# EasyEDA schematic SCH_Control-Board_2024-08-24.json
TITLE: Avalon Series Control Board; REV: 4.0; Date: 2024-06-21; Sheet: 1/1; Drawn By: edwardkeate; Company: Stoke PEV Solutions UK LLP
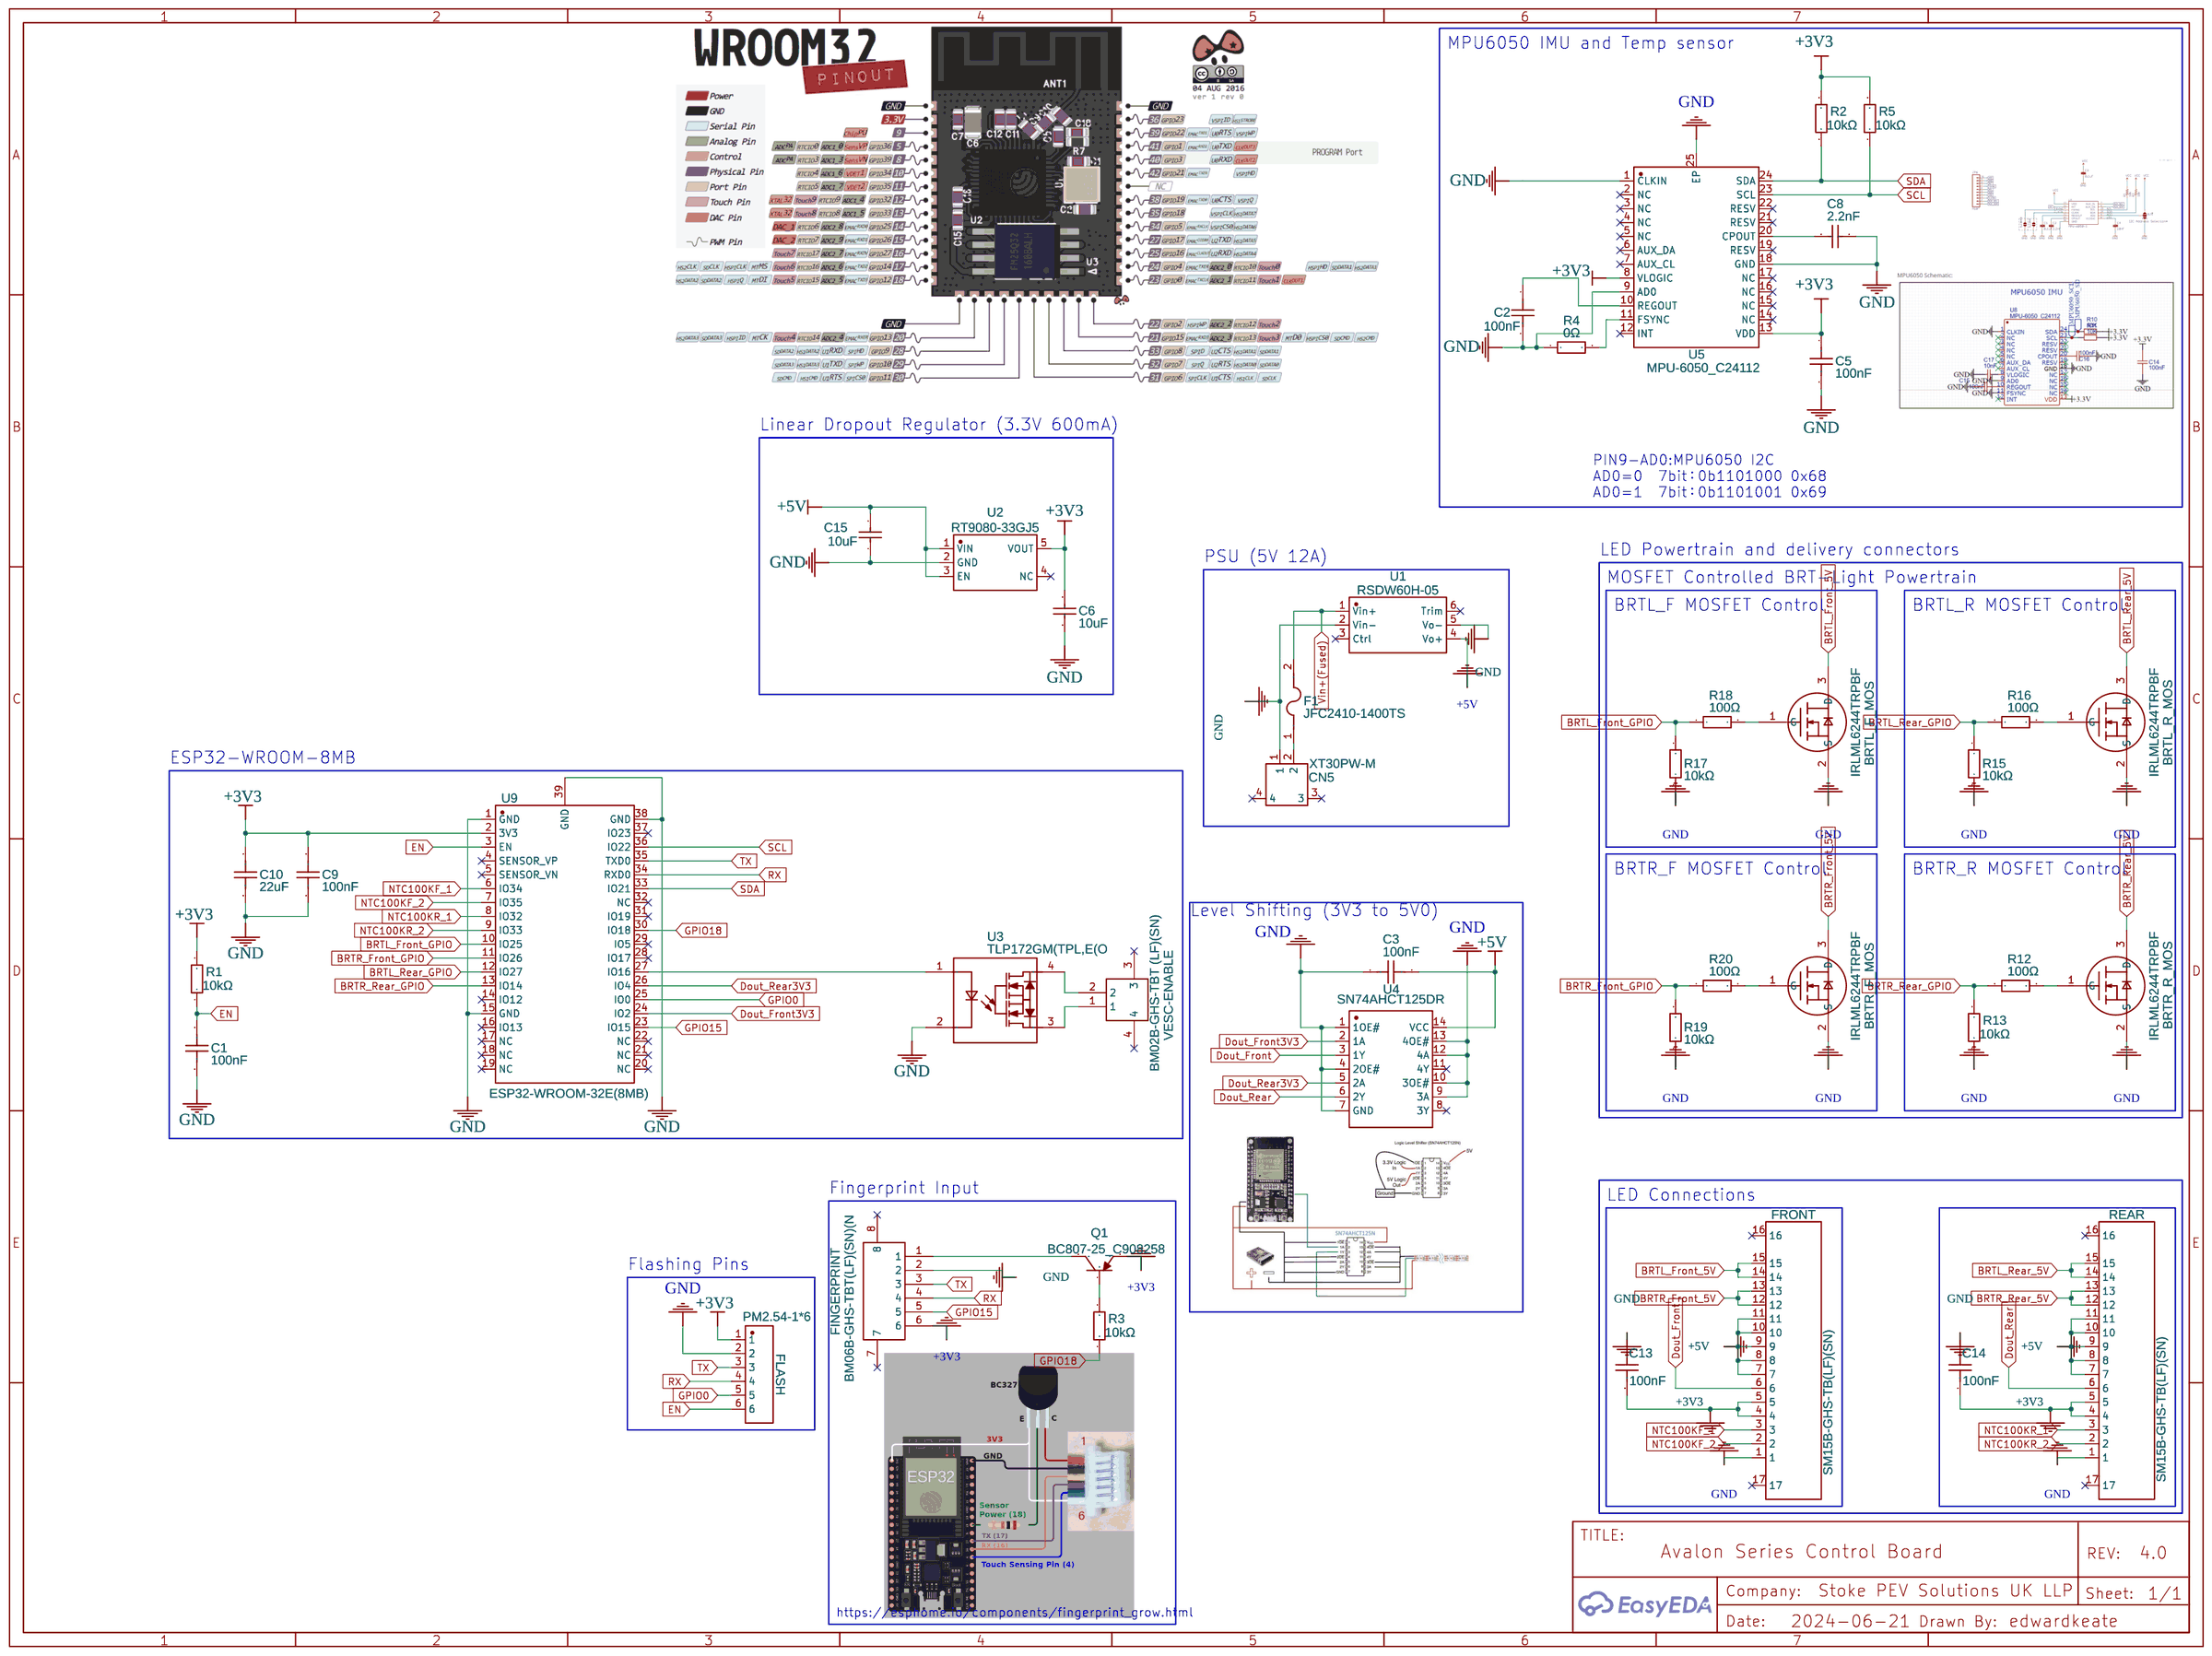
[diagram p0: schematic sheet]

## Parts
BRTL_F_MOS  IRLML6244TRPBF  [SOT-23-3_L2.9-W1.3-P1.90-LS2.4-BR]
BRTL_R_MOS  IRLML6244TRPBF  [SOT-23-3_L2.9-W1.3-P1.90-LS2.4-BR]
BRTR_F_MOS  IRLML6244TRPBF  [SOT-23-3_L2.9-W1.3-P1.90-LS2.4-BR]
BRTR_R_MOS  IRLML6244TRPBF  [SOT-23-3_L2.9-W1.3-P1.90-LS2.4-BR]
C1  100nF  [C0603]
C2  100nF  [C0603]
C3  100nF  [C0603]
C5  100nF  [C0603]
C6  10uF  [C0402]
C8  2.2nF  [C0805]
C9  100nF  [C0603]
C10  22uF  [C0603]
C13  100nF  [C0603]
C14  100nF  [C0603]
C15  10uF  [C0402]
CN5  XT30PW-M  [CONN-TH_XT30PW-M]
F1  JFC2410-1400TS  [FUSE-SMD_L6.1-W2.6]
FINGERPRINT  BM06B-GHS-TBT(LF)(SN)(N  [CONN-SMD_6P-P1.25_BM06B-GHS-TBT-LF-SN-N]
FLASH  PM2.54-1*6  [HDR-TH_6P-P2.54-V-F]
FRONT  SM15B-GHS-TB(LF)(SN)  [CONN-SMD_15P-P1.25_SM15B-GHS-TB-LF-SN]
Q1  BC807-25_C908258  [SOT-23-3_L2.9-W1.3-P1.90-LS2.4-BR]
R1  10kΩ  [R0603]
R2  10kΩ  [R0603]
R3  10kΩ  [R0603]
R4  0Ω  [R0603]
R5  10kΩ  [R0603]
R12  100Ω  [R0603]
R13  10kΩ  [R0603]
R15  10kΩ  [R0603]
R16  100Ω  [R0603]
R17  10kΩ  [R0603]
R18  100Ω  [R0603]
R19  10kΩ  [R0603]
R20  100Ω  [R0603]
REAR  SM15B-GHS-TB(LF)(SN)  [CONN-SMD_15P-P1.25_SM15B-GHS-TB-LF-SN]
U1  RSDW60H-05  [RSDW60H-05]
U2  RT9080-33GJ5  [TSOT-23-5_L2.9-W1.6-P0.95-LS2.8-BL]
U3  TLP172GM(TPL,E(O  [SMD-4_L4.6-W3.7-P2.54-LS7.0-BR]
U4  SN74AHCT125DR  [SOIC-14_L8.7-W3.9-P1.27-LS6.0-BL]
U5  MPU-6050_C24112  [QFN-24_L4.0-W4.0-P0.50-BL-EP2.7]
U9  ESP32-WROOM-32E(8MB)  [WIFI-SMD_ESP32-WROOM-32E]
VESC-ENABLE  BM02B-GHS-TBT (LF)(SN)  [CONN-SMD_2P-P1.25_BM02B-GHS-TBT-LF-SN]

## Library data of the parts
BRTL_F_MOS BRTL_R_MOS BRTR_F_MOS BRTR_R_MOS = IRLML6244TRPBF: Contributor: LCSC; Supplier: LCSC; Manufacturer: Infineon(英飞凌); Supplier Part: C143946; JLCPCB Part Class: Extended Part
C1-C3 C5 C9 C13 C14 = CC0603KRX7R9BB104: Supplier: LCSC; Manufacturer: YAGEO(国巨); Supplier Part: C14663; JLCPCB Part Class: Basic Part
C6 C15 = CL05A106MQ5NUNC: Supplier: LCSC; Manufacturer: SAMSUNG(三星); Supplier Part: C15525; JLCPCB Part Class: Basic Part
C8 = CL21C222JBFNNNE: Supplier: LCSC; Manufacturer: SAMSUNG(三星); Supplier Part: C28260; JLCPCB Part Class: Basic Part
C10 = CL10A226MQ8NRNC: Supplier: LCSC; Manufacturer: SAMSUNG(三星); Supplier Part: C59461; JLCPCB Part Class: Basic Part
CN5 = XT30PW-M: Contributor: LCSC; Supplier: LCSC; Supplier Part: C431092; Manufacturer: AMASS(艾迈斯); JLCPCB Part Class: Extended Part
F1 = JFC2410-1400TS: Contributor: LCSC; Supplier: LCSC; Manufacturer: JDTfuse(集电通); Supplier Part: C136386; JLCPCB Part Class: Extended Part
FINGERPRINT = BM06B-GHS-TBT(LF)(SN)(N: Contributor: LCSC; Supplier: LCSC; Supplier Part: C189892; Manufacturer: JST; Manufacturer Part: BM06B-GHS-TBT(LF)(SN); JLCPCB Part Class: Extended Part
FLASH = PM2.54-1*6: Contributor: lcsc; Supplier: LCSC; Supplier Part: C5224026; Manufacturer: ZHOURI(洲日); JLCPCB Part Class: Extended Part
FRONT REAR = SM15B-GHS-TB(LF)(SN): Contributor: LCSC; Supplier: LCSC; Supplier Part: C265027; Manufacturer: JST; JLCPCB Part Class: Extended Part
Q1 = BC807-25_C908258: Contributor: LCSC; Supplier: LCSC; Supplier Part: C908258; Manufacturer: FUXINSEMI(富芯森美); Manufacturer Part: BC807-25; JLCPCB Part Class: Extended Part
R1-R3 R5 R13 R15 R17 R19 = 0603WAF1002T5E: Supplier: LCSC; Manufacturer: UNI-ROYAL(厚声); Supplier Part: C25804; JLCPCB Part Class: Basic Part
R4 = 0603WAF0000T5E: Supplier: LCSC; Manufacturer: UNI-ROYAL(厚声); Supplier Part: C21189; JLCPCB Part Class: Basic Part
R12 R16 R18 R20 = 0603WAF1000T5E: Supplier: LCSC; Manufacturer: UNI-ROYAL(厚声); Supplier Part: C22775; JLCPCB Part Class: Basic Part
U1 = RSDW60H-05: Manufacturer: MEAN WELL USA Inc.; Supplier: Digi-Key; Supplier Part: 1866-RSDW60H-05-ND; link: https://www.digikey.co.uk/short/zwqdqzjq; Contributor: edwardkeate
U2 = RT9080-33GJ5: Contributor: LCSC; Supplier: LCSC; Supplier Part: C841192; Manufacturer: RICHTEK(立锜); JLCPCB Part Class: Extended Part
U3 = TLP172GM(TPL,E(O: Contributor: LCSC; Supplier: LCSC; Supplier Part: C261926; Manufacturer: TOSHIBA(东芝); JLCPCB Part Class: Extended Part
U4 = SN74AHCT125DR: Contributor: LCSC; Supplier: LCSC; Manufacturer: TI(德州仪器); Supplier Part: C155176; JLCPCB Part Class: Extended Part
U5 = MPU-6050_C24112: sourceId: 1T5FDZYC8; Supplier: LCSC; Manufacturer: TDK InvenSense(应美盛); Manufacturer Part: MPU-6050; Supplier Part: C24112; JLCPCB Part Class: Extended Part
U9 = ESP32-WROOM-32E(8MB): Supplier: LCSC; Supplier Part: C701342; Manufacturer: Espressif Systems; Contributor: LCSC; JLCPCB Part Class: Extended Part
VESC-ENABLE = BM02B-GHS-TBT (LF)(SN): Contributor: LCSC; Supplier: LCSC; Supplier Part: C161690; Manufacturer: JST; Manufacturer Part: BM02B-GHS-TBT(LF)(SN); JLCPCB Part Class: Extended Part

## Nets
+3V3: C5.1 C6.2 C9.1 C10.1 C13.2 C14.2 FINGERPRINT.6 FLASH.1 FRONT.4 FRONT.5 Q1.2(E) R1.2 R2.2 R5.2 REAR.4 REAR.5 U2.5(VOUT) U5.8(VLOGIC) U5.13(VDD) U9.2(3V3)
+5V: C3.1 C15.2 FRONT.7 FRONT.8 FRONT.9 FRONT.10 FRONT.11 REAR.7 REAR.8 REAR.9 REAR.10 REAR.11 U1.4(Vo+) U2.1(VIN) U2.3(EN) U4.14(VCC)
GND: BRTL_F_MOS.2(S) BRTL_R_MOS.2(S) BRTR_F_MOS.2(S) BRTR_R_MOS.2(S) C1.2 C2.2 C3.2 C5.2 C6.1 C8.2 C9.2 C10.2 C13.1 C14.1 C15.1 CN5.1 FINGERPRINT.2 FLASH.2 FRONT.1 R4.1 R13.1 R15.1 R17.1 R19.1 REAR.1 U1.2(Vin-) U1.5(Vo-) U2.2(GND) U3.2 U4.1(1OE#) U4.4(2OE#) U4.7(GND) U4.9(3A) U4.10(3OE#) U4.12(4A) U4.13(4OE#) U5.1(CLKIN) U5.9(AD0) U5.18(GND) U5.25(EP) U9.1(GND) U9.15(GND) U9.38(GND) U9.39(GND)
Vin+(Fused): F1.2 U1.1(Vin+)
BRTL_Front_5V: BRTL_F_MOS.3(D) FRONT.14 FRONT.15
BRTL_Front_GPIO: R17.2 R18.1 U9.10(IO25)
BRTL_Rear_5V: BRTL_R_MOS.3(D) REAR.14 REAR.15
BRTL_Rear_GPIO: R15.2 R16.1 U9.12(IO27)
BRTR_Front_5V: BRTR_F_MOS.3(D) FRONT.12 FRONT.13
BRTR_Front_GPIO: R19.2 R20.1 U9.11(IO26)
BRTR_Rear_5V: BRTR_R_MOS.3(D) REAR.12 REAR.13
BRTR_Rear_GPIO: R12.1 R13.2 U9.13(IO14)
Dout_Front: FRONT.6 U4.3(1Y)
Dout_Front3V3: U4.2(1A) U9.24(IO2)
Dout_Rear: REAR.6 U4.6(2Y)
Dout_Rear3V3: U4.5(2A) U9.26(IO4)
EN: C1.1 FLASH.6 R1.1 U9.3(EN)
GPIO0: FLASH.5 U9.25(IO0)
GPIO15: FINGERPRINT.5 U9.23(IO15)
GPIO18: R3.1 U9.30(IO18)
NTC100KF_1: FRONT.3 U9.6(IO34)
NTC100KF_2: FRONT.2 U9.7(IO35)
NTC100KR_1: REAR.3 U9.8(IO32)
NTC100KR_2: REAR.2 U9.9(IO33)
RX: FINGERPRINT.4 FLASH.4 U9.34(RXD0)
SCL: R5.1 U5.23(SCL) U9.36(IO22)
SDA: R2.1 U5.24(SDA) U9.33(IO21)
TX: FINGERPRINT.3 FLASH.3 U9.35(TXD0)
Net-(BRTL_F_MOS-1): BRTL_F_MOS.1(G) R18.2
Net-(BRTL_R_MOS-1): BRTL_R_MOS.1(G) R16.2
Net-(BRTR_F_MOS-1): BRTR_F_MOS.1(G) R20.2
Net-(BRTR_R_MOS-1): BRTR_R_MOS.1(G) R12.2
Net-(C2-1): C2.1 U5.10(REGOUT)
Net-(C8-1): C8.1 U5.20(CPOUT)
Net-(CN5-2): CN5.2 F1.1
Net-(FINGERPRINT-1): FINGERPRINT.1 Q1.3(C)
Net-(Q1-1): Q1.1(B) R3.2
Net-(R4-2): R4.2 U5.11(FSYNC)
Net-(U3-1): U3.1 U9.27(IO16)
Net-(U3-3): U3.3 VESC-ENABLE.1
Net-(U3-4): U3.4 VESC-ENABLE.2

Not connected (* = marked no-connect by the designer): CN5 3* 4*; FINGERPRINT 7* 8*; FRONT 16* 17*; REAR 16* 17*; U1 3(Ctrl)* 6(Trim)*; U2 4(NC)*; U4 8(3Y)* 11(4Y)*; U5 2(NC)* 3(NC)* 4(NC)* 5(NC)* 6(AUX_DA)* 7(AUX_CL)* 12(INT)* 14(NC)* 15(NC)* 16(NC)* 17(NC)* 19(RESV)* 21(RESV)* 22(RESV)*; U9 4(SENSOR_VP)* 5(SENSOR_VN)* 14(IO12)* 16(IO13)* 17(NC)* 18(NC)* 19(NC)* 20(NC)* 21(NC)* 22(NC)* 28(IO17)* 29(IO5)* 31(IO19)* 32(NC)* 37(IO23)*; VESC-ENABLE 3* 4*

## Notes on the sheet
- MPU6050 IMU and Temp sensor
- Linear Dropout Regulator (3.3V 600mA)
- PIN9-AD0:MPU6050 I2C
  AD0=0  7bit：0b1101000 0x68
  AD0=1  7bit：0b1101001 0x69
- PSU (5V 12A)
- LED Powertrain and delivery connectors
- MOSFET Controlled BRT-Light Powertrain
- BRTL_F MOSFET Control
- BRTL_R MOSFET Control
- ESP32-WROOM-8MB
- BRTR_F MOSFET Control
- BRTR_R MOSFET Control
- Level Shifting (3V3 to 5V0)
- Fingerprint Input
- LED Connections
- Flashing Pins
- https://esphome.io/components/fingerprint_grow.html
